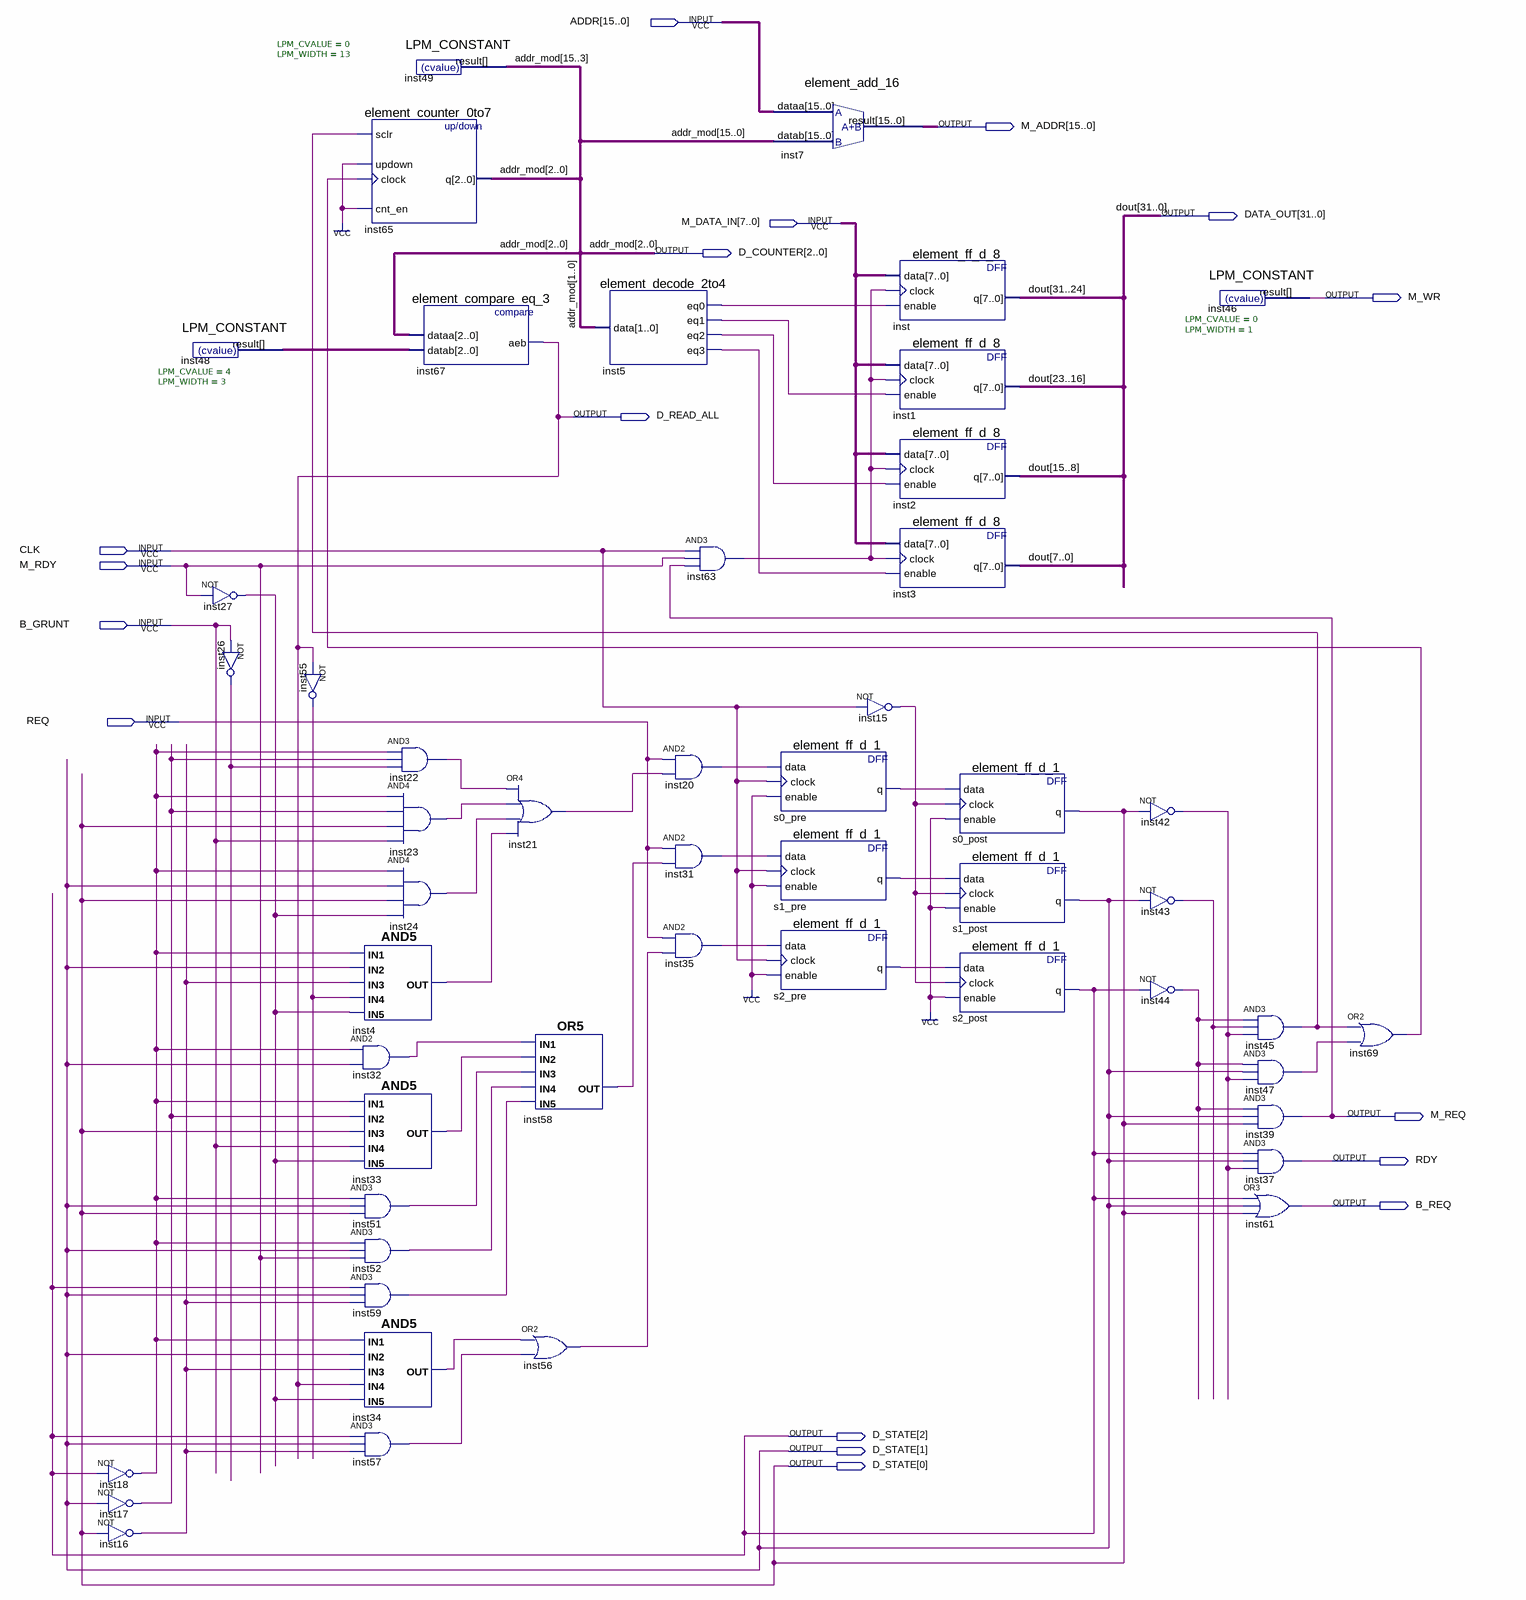
[diagram p0: schematic sheet]
// Quartus schematic block-data-cache-reader.bdf as structural Verilog: 51 symbols, 17 pins
module \block-data-cache-reader  (
  input  [15:0] ADDR,
  input  [7:0] M_DATA_IN,
  input  CLK,
  input  M_RDY,
  input  B_GRUNT,
  input  REQ,
  output [15:0] M_ADDR,
  output [31:0] DATA_OUT,
  output [2:0] D_COUNTER,
  output M_WR,
  output D_READ_ALL,
  output M_REQ,
  output RDY,
  output B_REQ,
  output [2:0] D_STATE
);

  wire inst4_out, inst5_eq0, inst5_eq1, inst5_eq2, inst5_eq3, inst15_out, inst16_out, inst17_out, inst18_out,
       inst20_out, inst21_out, inst22_out, inst23_out, inst24_out, inst26_out, inst27_out, inst31_out,
       inst32_out, inst33_out, inst34_out, inst35_out, inst42_out, inst43_out, inst44_out, inst45_out,
       inst47_out, inst51_out, inst52_out, inst55_out, inst56_out, inst57_out, inst58_out, inst59_out,
       inst63_out, inst69_out, s0_pre_q, s1_pre_q, s2_pre_q;
  wire [2:0] inst48_result;
  wire [15:3] addr_mod;

  not inst18 (inst18_out, D_STATE[2]);
  not inst17 (inst17_out, D_STATE[1]);
  not inst16 (inst16_out, D_STATE[0]);
  LPM_CONSTANT #(.LPM_CVALUE(4), .LPM_WIDTH(3)) inst48 (.result(inst48_result));
  not inst27 (inst27_out, M_RDY);
  not inst26 (inst26_out, B_GRUNT);
  not inst55 (inst55_out, D_READ_ALL);
  element_counter_0to7 inst65 (.sclr(inst45_out), .updown(1'b1), .clock(inst69_out), .cnt_en(1'b1), .q(D_COUNTER));
  and inst4 (inst4_out, inst18_out, D_STATE[1], inst16_out, inst55_out, inst27_out);
  and inst32 (inst32_out, inst18_out, D_STATE[1]);
  and inst33 (inst33_out, inst18_out, inst17_out, D_STATE[0], B_GRUNT, inst27_out);
  and inst51 (inst51_out, inst18_out, D_STATE[1], D_STATE[0]);
  and inst52 (inst52_out, inst18_out, D_STATE[1], M_RDY);
  and inst59 (inst59_out, D_STATE[2], D_STATE[1], inst16_out);
  and inst34 (inst34_out, inst18_out, D_STATE[1], inst16_out, D_READ_ALL, inst27_out);
  and inst57 (inst57_out, D_STATE[2], D_STATE[1], inst16_out);
  LPM_CONSTANT #(.LPM_CVALUE(0), .LPM_WIDTH(13)) inst49 (.result(addr_mod));
  element_compare_eq_3 inst67 (.dataa(D_COUNTER), .datab(inst48_result), .aeb(D_READ_ALL));
  and inst22 (inst22_out, inst18_out, inst17_out, inst26_out);
  and inst23 (inst23_out, inst18_out, inst17_out, D_STATE[0], B_GRUNT);
  and inst24 (inst24_out, inst18_out, D_STATE[1], D_STATE[0], inst27_out);
  or inst21 (inst21_out, inst22_out, inst23_out, inst24_out, inst4_out);
  or inst58 (inst58_out, inst32_out, inst33_out, inst51_out, inst52_out, inst59_out);
  or inst56 (inst56_out, inst34_out, inst57_out);
  element_decode_2to4 inst5 (.data(D_COUNTER[1:0]), .eq0(inst5_eq0), .eq1(inst5_eq1), .eq2(inst5_eq2), .eq3(inst5_eq3));
  and inst20 (inst20_out, REQ, inst21_out);
  and inst31 (inst31_out, REQ, inst58_out);
  and inst35 (inst35_out, REQ, inst56_out);
  and inst63 (inst63_out, CLK, M_RDY, M_REQ);
  element_add_16 inst7 (.dataa(ADDR), .datab({addr_mod, D_COUNTER}), .result(M_ADDR));
  element_ff_d_1 s0_pre (.data(inst20_out), .clock(CLK), .enable(1'b1), .q(s0_pre_q));
  element_ff_d_1 s1_pre (.data(inst31_out), .clock(CLK), .enable(1'b1), .q(s1_pre_q));
  element_ff_d_1 s2_pre (.data(inst35_out), .clock(CLK), .enable(1'b1), .q(s2_pre_q));
  not inst15 (inst15_out, CLK);
  element_ff_d_8 inst (.data(M_DATA_IN), .clock(inst63_out), .enable(inst5_eq0), .q(DATA_OUT[31:24]));
  element_ff_d_8 inst1 (.data(M_DATA_IN), .clock(inst63_out), .enable(inst5_eq1), .q(DATA_OUT[23:16]));
  element_ff_d_8 inst2 (.data(M_DATA_IN), .clock(inst63_out), .enable(inst5_eq2), .q(DATA_OUT[15:8]));
  element_ff_d_8 inst3 (.data(M_DATA_IN), .clock(inst63_out), .enable(inst5_eq3), .q(DATA_OUT[7:0]));
  element_ff_d_1 s0_post (.data(s0_pre_q), .clock(inst15_out), .enable(1'b1), .q(D_STATE[0]));
  element_ff_d_1 s1_post (.data(s1_pre_q), .clock(inst15_out), .enable(1'b1), .q(D_STATE[1]));
  element_ff_d_1 s2_post (.data(s2_pre_q), .clock(inst15_out), .enable(1'b1), .q(D_STATE[2]));
  not inst42 (inst42_out, D_STATE[0]);
  not inst43 (inst43_out, D_STATE[1]);
  not inst44 (inst44_out, D_STATE[2]);
  LPM_CONSTANT #(.LPM_CVALUE(0), .LPM_WIDTH(1)) inst46 (.result(M_WR));
  and inst45 (inst45_out, inst44_out, inst43_out, inst42_out);
  and inst47 (inst47_out, inst44_out, D_STATE[1], inst42_out);
  and inst39 (M_REQ, inst44_out, D_STATE[1], D_STATE[0]);
  and inst37 (RDY, D_STATE[2], D_STATE[1], inst42_out);
  or inst61 (B_REQ, D_STATE[2], D_STATE[1], D_STATE[0]);
  or inst69 (inst69_out, inst45_out, inst47_out);

  // Other names for the same wires on the sheet: addr_mod[2:0] = D_COUNTER; dout[31:0] = DATA_OUT
endmodule
